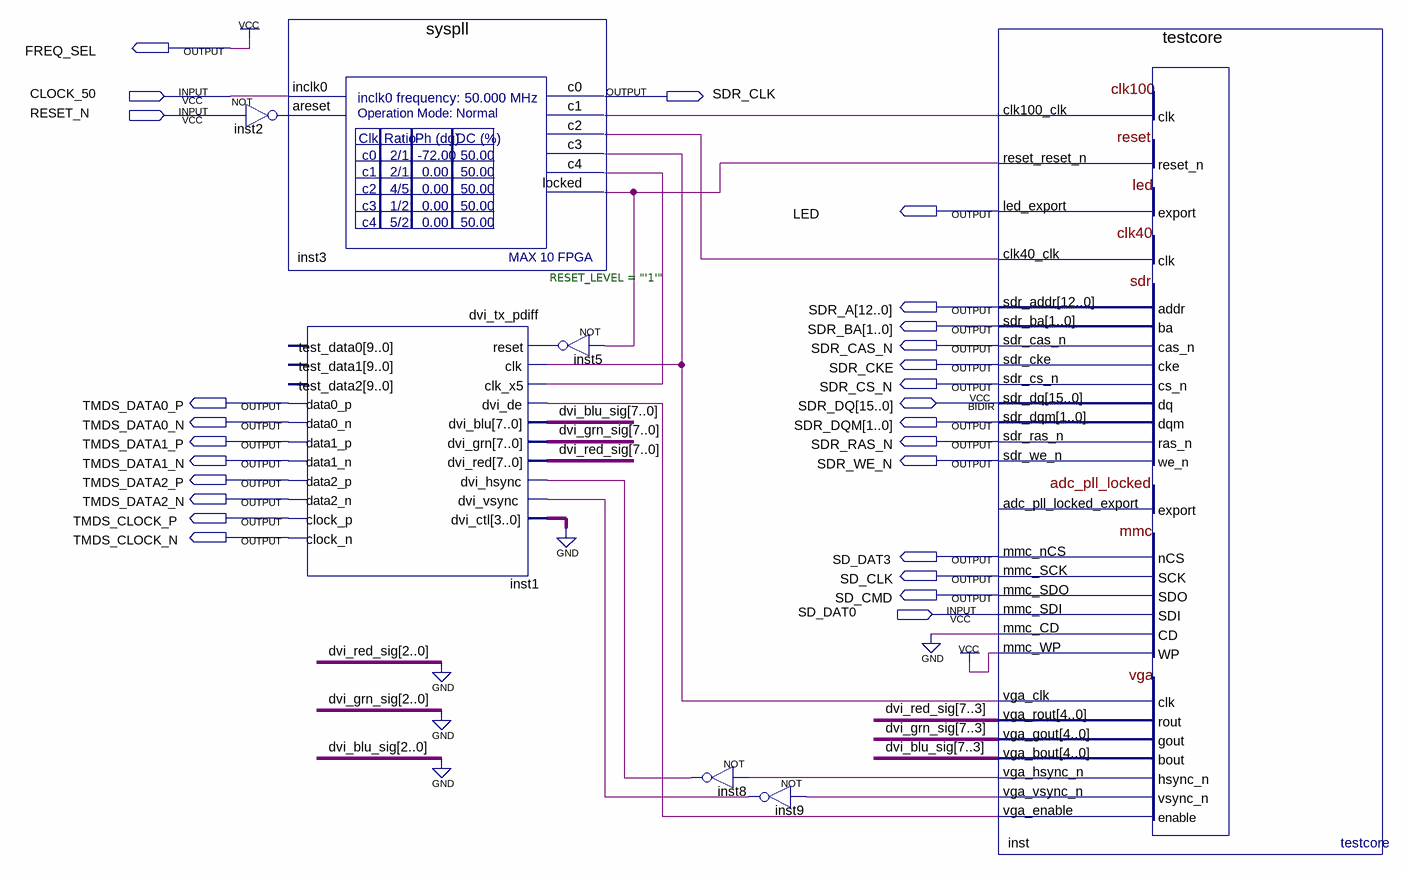
[diagram p0: schematic sheet]
// Quartus schematic ckplay_top.bdf as structural Verilog: 7 symbols, 26 pins
module ckplay_top (
  input  CLOCK_50,
  input  RESET_N,
  input  SD_DAT0,
  inout  [15:0] SDR_DQ,
  output FREQ_SEL,
  output SDR_CLK,
  output LED,
  output [12:0] SDR_A,
  output [1:0] SDR_BA,
  output SDR_CAS_N,
  output SDR_CKE,
  output SDR_CS_N,
  output TMDS_DATA0_P,
  output TMDS_DATA0_N,
  output [1:0] SDR_DQM,
  output TMDS_DATA1_P,
  output SDR_RAS_N,
  output TMDS_DATA1_N,
  output SDR_WE_N,
  output TMDS_DATA2_P,
  output TMDS_DATA2_N,
  output TMDS_CLOCK_P,
  output TMDS_CLOCK_N,
  output SD_DAT3,
  output SD_CLK,
  output SD_CMD
);

  wire inst2_out, inst3_c1, inst3_c2, inst3_c3, inst3_c4, inst3_locked, inst5_out, inst8_out, inst9_out,
       inst_vga_enable, inst_vga_hsync_n, inst_vga_vsync_n;
  wire [7:3] dvi_blu_sig, dvi_grn_sig, dvi_red_sig;

  not inst2 (inst2_out, RESET_N);
  syspll inst3 (
    .inclk0(CLOCK_50), .areset(inst2_out), .c0(SDR_CLK), .c1(inst3_c1), .c2(inst3_c2), .c3(inst3_c3),
    .c4(inst3_c4), .locked(inst3_locked));
  dvi_tx_pdiff #(.RESET_LEVEL("'1'")) inst1 (
    .reset(inst5_out), .clk(inst3_c3), .clk_x5(inst3_c4), .dvi_de(inst_vga_enable),
    .dvi_blu({dvi_blu_sig, 3'b000}), .dvi_grn({dvi_grn_sig, 3'b000}), .dvi_red({dvi_red_sig, 3'b000}),
    .dvi_hsync(inst8_out), .dvi_vsync(inst9_out), .dvi_ctl(4'b0000), .data0_p(TMDS_DATA0_P),
    .data0_n(TMDS_DATA0_N), .data1_p(TMDS_DATA1_P), .data1_n(TMDS_DATA1_N), .data2_p(TMDS_DATA2_P),
    .data2_n(TMDS_DATA2_N), .clock_p(TMDS_CLOCK_P), .clock_n(TMDS_CLOCK_N));  // open: test_data0, test_data1, test_data2
  not inst5 (inst5_out, inst3_locked);
  not inst8 (inst8_out, inst_vga_hsync_n);
  not inst9 (inst9_out, inst_vga_vsync_n);
  testcore inst (
    .clk100_clk(inst3_c1), .reset_reset_n(inst3_locked), .clk40_clk(inst3_c2), .mmc_SDI(SD_DAT0),
    .mmc_CD(1'b0), .mmc_WP(1'b1), .vga_clk(inst3_c3), .led_export(LED), .sdr_addr(SDR_A), .sdr_ba(SDR_BA),
    .sdr_cas_n(SDR_CAS_N), .sdr_cke(SDR_CKE), .sdr_cs_n(SDR_CS_N), .sdr_dqm(SDR_DQM), .sdr_ras_n(SDR_RAS_N),
    .sdr_we_n(SDR_WE_N), .mmc_nCS(SD_DAT3), .mmc_SCK(SD_CLK), .mmc_SDO(SD_CMD), .vga_rout(dvi_red_sig),
    .vga_gout(dvi_grn_sig), .vga_bout(dvi_blu_sig), .vga_hsync_n(inst_vga_hsync_n),
    .vga_vsync_n(inst_vga_vsync_n), .vga_enable(inst_vga_enable), .sdr_dq(SDR_DQ));  // open: adc_pll_locked_export

  assign FREQ_SEL = 1'b1;
endmodule
